# EAGLE schematic Shield_FT (EAGLE 9.5.1)
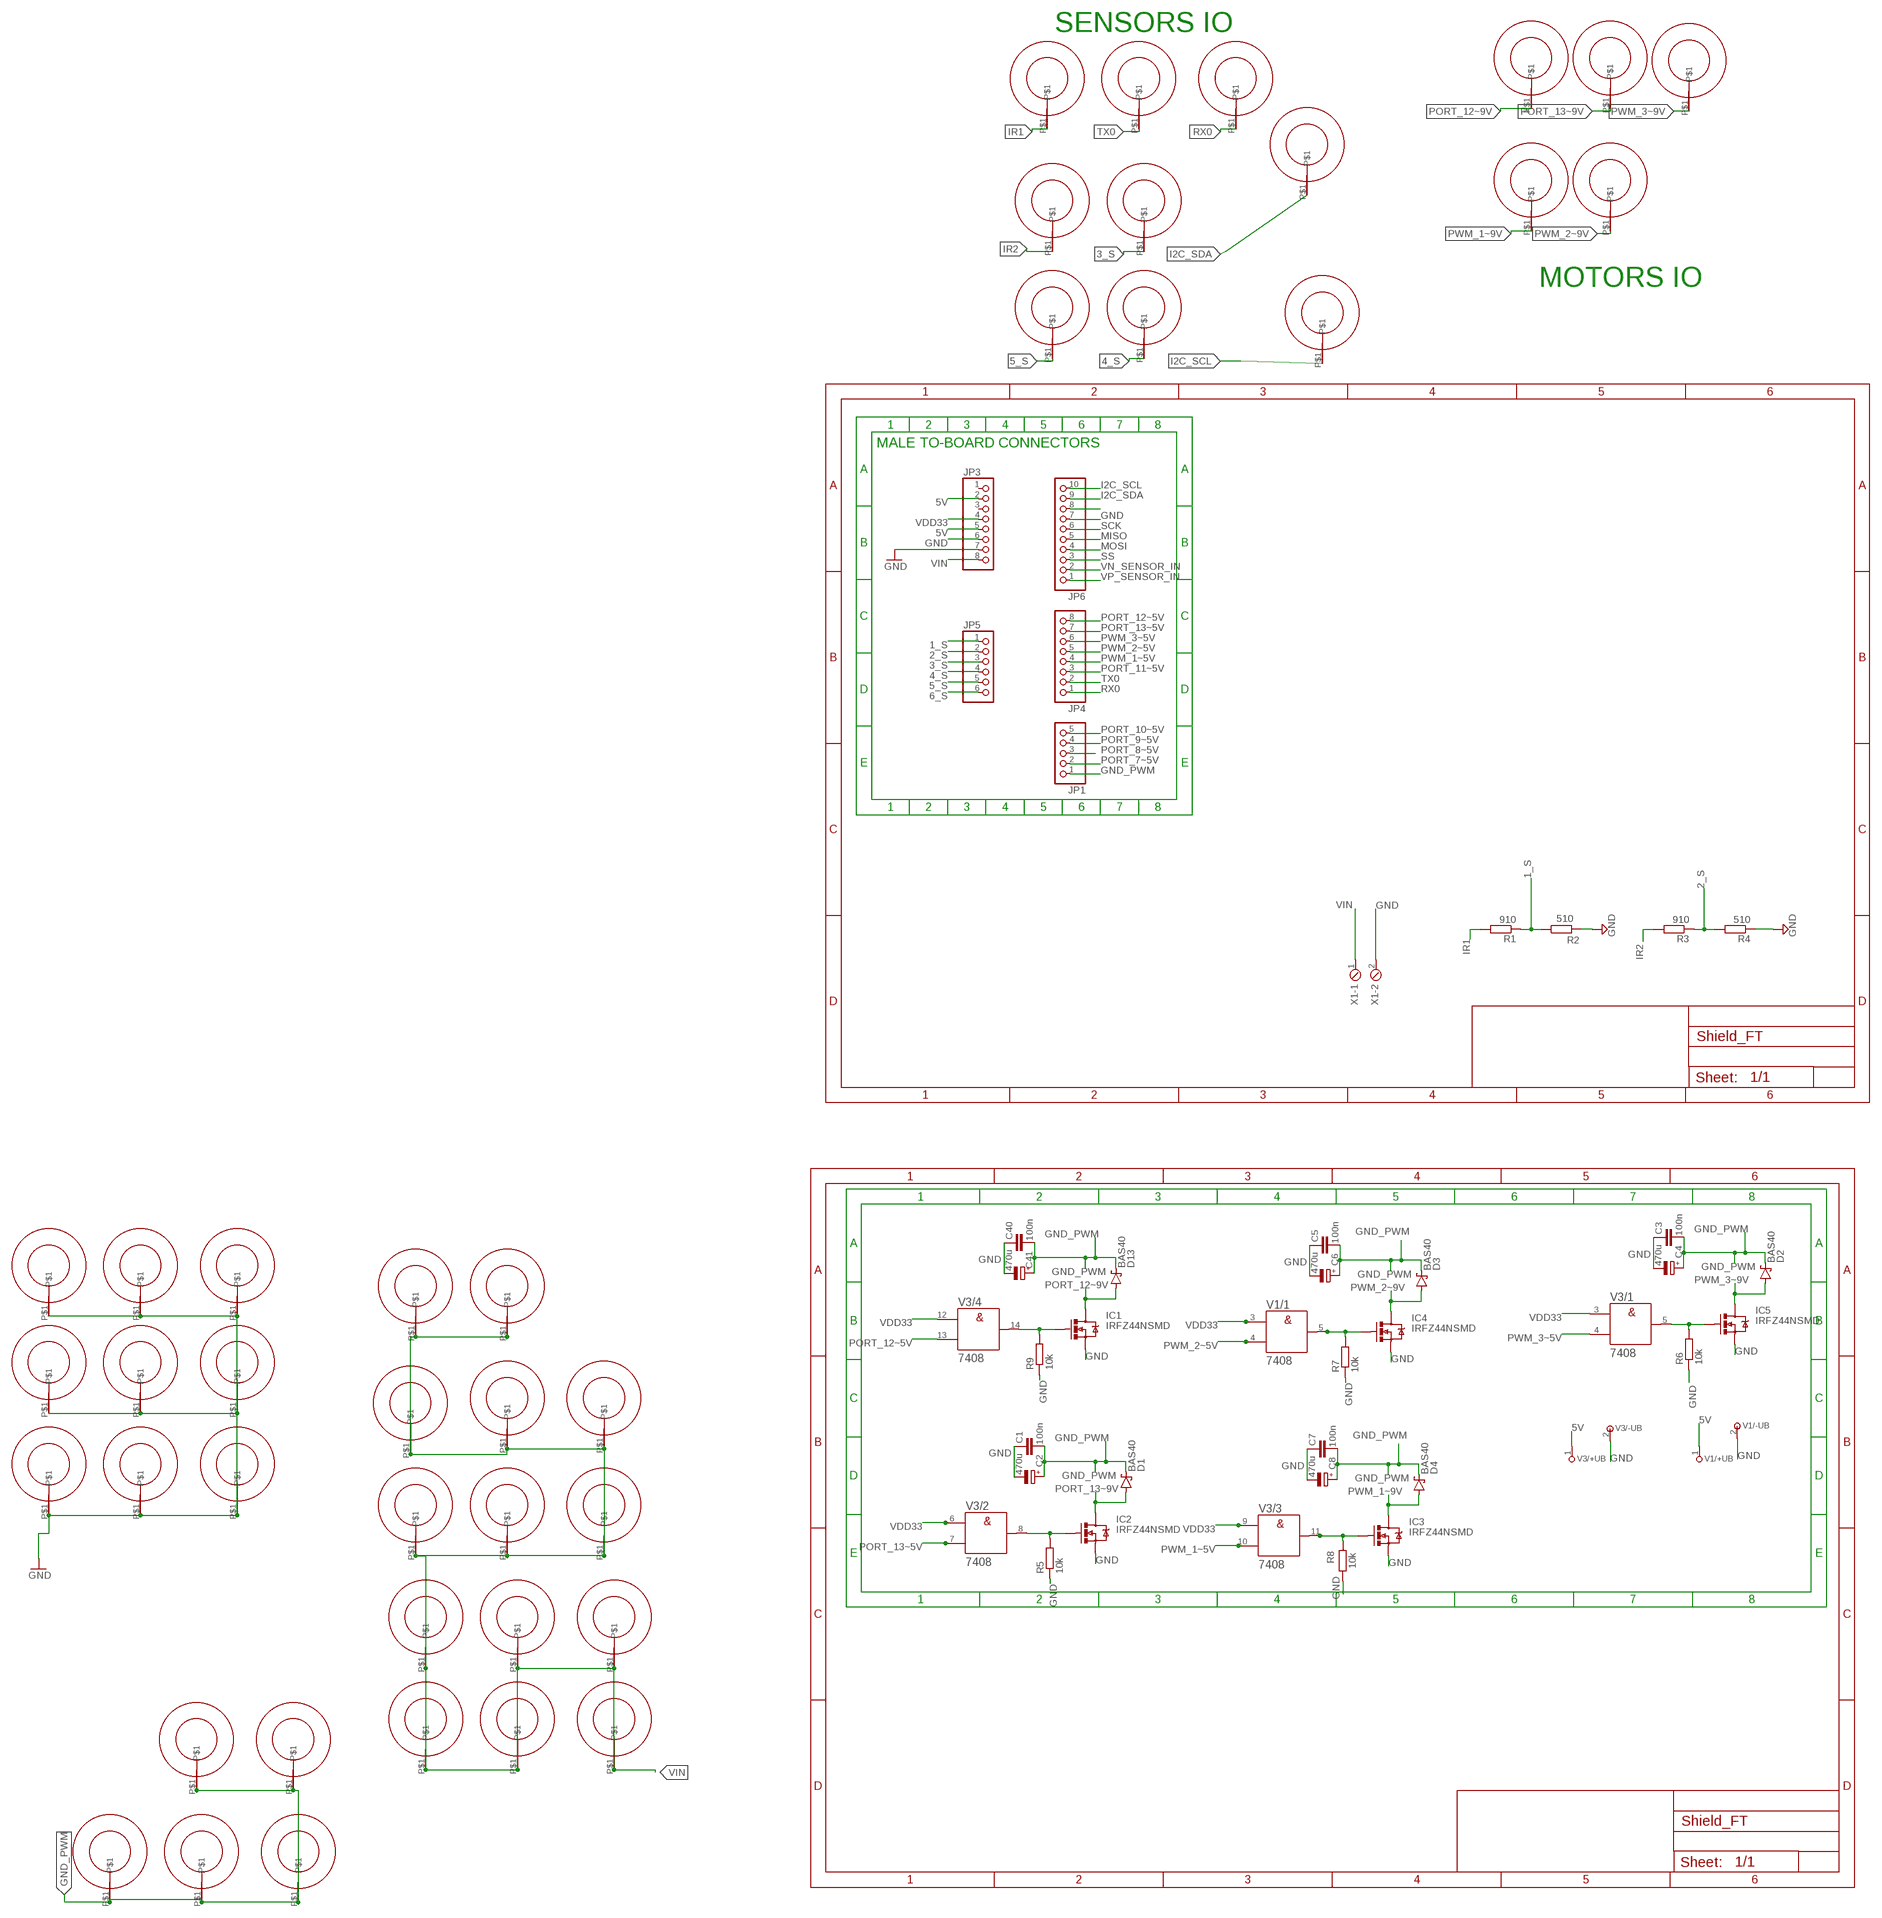
[diagram p0: schematic, sheet 1]

## Parts
C1  100n  C-EUC0402  [C0402]
C2  470u  CPOL-EU  [PANASONIC_B_FT]
C3  100n  C-EUC0402  [C0402]
C4  470u  CPOL-EU  [PANASONIC_B_FT]
C5  100n  C-EUC0402  [C0402]
C6  470u  CPOL-EU  [PANASONIC_B_FT]
C7  100n  C-EUC0402  [C0402]
C8  470u  CPOL-EU  [PANASONIC_B_FT]
C40  100n  C-EUC0402  [C0402]
C41  470u  CPOL-EU  [PANASONIC_B_FT]
D1  BAS40  [SOT23]
D2  BAS40  [SOT23]
D3  BAS40  [SOT23]
D4  BAS40  [SOT23]
D13  BAS40  [SOT23]
IC1  IRFZ44NSMD  [SMD]
IC2  IRFZ44NSMD  [SMD]
IC3  IRFZ44NSMD  [SMD]
IC4  IRFZ44NSMD  [SMD]
IC5  IRFZ44NSMD  [SMD]
JP1  PINHD-1X5_2.54-SMD  [1X05SMD]
JP3  PINHD-1X8_2.54-SMD  [1X08SMD]
JP4  PINHD-1X8_2.54-SMD  [1X08SMD]
JP5  PINHD-1X6_2.54-SMD  [1X06SMD]
JP6  PINHD-1X10_2.54-SMD  [1X10SMD]
R1  910  R-EU_M0805  [M0805]
R2  510  R-EU_M0805  [M0805]
R3  910  R-EU_M0805  [M0805]
R4  510  R-EU_M0805  [M0805]
R5  10k  R-EU_M0805  [M0805]
R6  10k  R-EU_M0805  [M0805]
R7  10k  R-EU_M0805  [M0805]
R8  10k  R-EU_M0805  [M0805]
R9  10k  R-EU_M0805  [M0805]
U$1  SOCKET  [SOCKET]
U$2  SOCKET  [SOCKET]
U$3  SOCKET  [SOCKET]
U$7  SOCKET  [SOCKET]
U$8  SOCKET  [SOCKET]
U$11  SOCKET  [SOCKET]
U$12  SOCKET  [SOCKET]
U$13  SOCKET  [SOCKET]
U$14  SOCKET  [SOCKET]
U$43  SOCKET  [SOCKET]
U$44  SOCKET  [SOCKET]
U$45  SOCKET  [SOCKET]
U$46  SOCKET  [SOCKET]
U$47  SOCKET  [SOCKET]
U$48  SOCKET  [SOCKET]
U$49  SOCKET  [SOCKET]
U$50  SOCKET  [SOCKET]
U$51  SOCKET  [SOCKET]
U$52  SOCKET  [SOCKET]
U$53  SOCKET  [SOCKET]
U$54  SOCKET  [SOCKET]
U$55  SOCKET  [SOCKET]
U$56  SOCKET  [SOCKET]
U$57  SOCKET  [SOCKET]
U$58  SOCKET  [SOCKET]
U$59  SOCKET  [SOCKET]
U$60  SOCKET  [SOCKET]
U$61  SOCKET  [SOCKET]
U$62  SOCKET  [SOCKET]
U$63  SOCKET  [SOCKET]
U$64  SOCKET  [SOCKET]
U$65  SOCKET  [SOCKET]
U$66  SOCKET  [SOCKET]
U$68  SOCKET  [SOCKET]
U$69  SOCKET  [SOCKET]
U$70  SOCKET  [SOCKET]
U$71  SOCKET  [SOCKET]
U$73  SOCKET  [SOCKET]
U$74  SOCKET  [SOCKET]
U$75  SOCKET  [SOCKET]
U$77  SOCKET  [SOCKET]
U$78  SOCKET  [SOCKET]
V1  7408  [DIL14_FT]
V3  7408  [DIL14_FT]
X1  MPT21.3  [2POL254_1.3]

## Nets
1_S: JP5.1 R1.1 R2.1
2_S: JP5.2 R3.1 R4.2
3_S: JP5.3 U$8.P$1
4_S: JP5.4 U$44.P$1
5_S: JP5.5 U$43.P$1
5V: JP3.2 JP3.5 V1.1(/+UB:+UB) V3.1(/+UB:+UB)
6_S: JP5.6
GND: C1.1 C2.- C3.1 C4.- C5.1 C6.- C7.1 C8.- C40.1 C41.- IC1.3(S) IC2.3(S) IC3.3(S) IC4.3(S) IC5.3(S) JP3.6 JP3.7 JP6.7 R2.2 R4.1 R5.1 R6.1 R7.1 R8.1 R9.1 U$49.P$1 U$50.P$1 U$51.P$1 U$52.P$1 U$53.P$1 U$54.P$1 U$55.P$1 U$56.P$1 U$57.P$1 V1.2(/-UB:-UB) V3.2(/-UB:-UB) X1.2
GND_PWM: C1.2 C2.+ C3.2 C4.+ C5.2 C6.+ C7.2 C8.+ C40.2 C41.+ D1.3(C) D2.3(C) D3.3(C) D4.3(C) D13.3(C) JP1.1 U$73.P$1 U$74.P$1 U$75.P$1 U$77.P$1 U$78.P$1
I2C_SCL: JP6.10 U$45.P$1
I2C_SDA: JP6.9 U$13.P$1
IR1: R1.2 U$46.P$1
IR2: R3.2 U$7.P$1
MISO: JP6.5
MOSI: JP6.4
N$1: IC2.1(G) R5.2 V3.8(/2:Y)
N$3: IC5.1(G) R6.2 V3.5(/1:Y)
N$5: IC4.1(G) R7.2 V1.5(/1:Y)
N$7: IC3.1(G) R8.2 V3.11(/3:Y)
N$26: JP6.8
N$36: IC1.1(G) R9.2 V3.14(/4:Y)
PORT_7~5V: JP1.2
PORT_8~5V: JP1.3
PORT_9~5V: JP1.4
PORT_10~5V: JP1.5
PORT_11~5V: JP4.3
PORT_12~5V: JP4.8 V3.13(/4:B)
PORT_12~9V: D13.1(A) IC1.2(D) U$11.P$1
PORT_13~5V: JP4.7 V3.7(/2:B)
PORT_13~9V: D1.1(A) IC2.2(D) U$14.P$1
PWM_1~5V: JP4.4 V3.10(/3:B)
PWM_1~9V: D4.1(A) IC3.2(D) U$2.P$1
PWM_2~5V: JP4.5 V1.4(/1:B)
PWM_2~9V: D3.1(A) IC4.2(D) U$3.P$1
PWM_3~5V: JP4.6 V3.4(/1:B)
PWM_3~9V: D2.1(A) IC5.2(D) U$12.P$1
RX0: JP4.1 U$48.P$1
SCK: JP6.6
SS: JP6.3
TX0: JP4.2 U$47.P$1
VDD33: JP3.4 V1.3(/1:A) V3.3(/1:A) V3.6(/2:A) V3.9(/3:A) V3.12(/4:A)
VIN: JP3.8 U$1.P$1 U$58.P$1 U$59.P$1 U$60.P$1 U$61.P$1 U$62.P$1 U$63.P$1 U$64.P$1 U$65.P$1 U$66.P$1 U$68.P$1 U$69.P$1 U$70.P$1 U$71.P$1 X1.1
VN_SENSOR_IN: JP6.2
VP_SENSOR_IN: JP6.1
Unconnected: JP3.1 JP3.3 V1.6(/2:A) V1.7(/2:B) V1.8(/2:Y) V1.9(/3:A) V1.10(/3:B) V1.11(/3:Y) V1.12(/4:A) V1.13(/4:B) V1.14(/4:Y)

## Notes on the sheet
- SENSORS IO
- MOTORS IO
- MALE TO-BOARD CONNECTORS

## Library data of the parts
C1 C3 C5 C7 C40 = rcl:C-EU: CAPACITOR, European symbol; SPICEPREFIX: C
C2 C4 C6 C8 C41 = rcl_FT_modified:CPOL-EU: POLARIZED CAPACITOR, European symbol
D1-D4 D13 = diode:BAS40: Silicon Schottky Diodes General-purpose diode for high-speed switching
IC1-IC5 = IRFZ44N:IRFZ44N
JP1 = pinhead-1:PINHD-1X5: PIN HEADER
JP3 JP4 = pinhead-1:PINHD-1X8: PIN HEADER
JP5 = pinhead-1:PINHD-1X6: PIN HEADER
JP6 = pinhead-1:PINHD-1X10: PIN HEADER
R1-R9 = rcl:R-EU_: RESISTOR, European symbol; SPICEPREFIX: R
U$1-U$3 U$7 U$8 U$11-U$14 U$43-U$66 U$68-U$71 U$73-U$75 U$77 U$78 = socket_2:SOCKET
V1 V3 = 74ttl-din_modified:74*08: Quad 2-input AND gate
X1 = con-phoenix-254:MPT2: PHOENIX CONNECTOR

## Net classes
0 default: width 0.61 mm, drill 0.61 mm, clearance 0.254 mm
1 x: width 0.203 mm, drill 0.508 mm, clearance 0.254 mm